# Altium schematic sheet 6DOF_CONTROLLER_Top.SchDoc
size A1; SheetNumber: 1; SheetTotal: 12
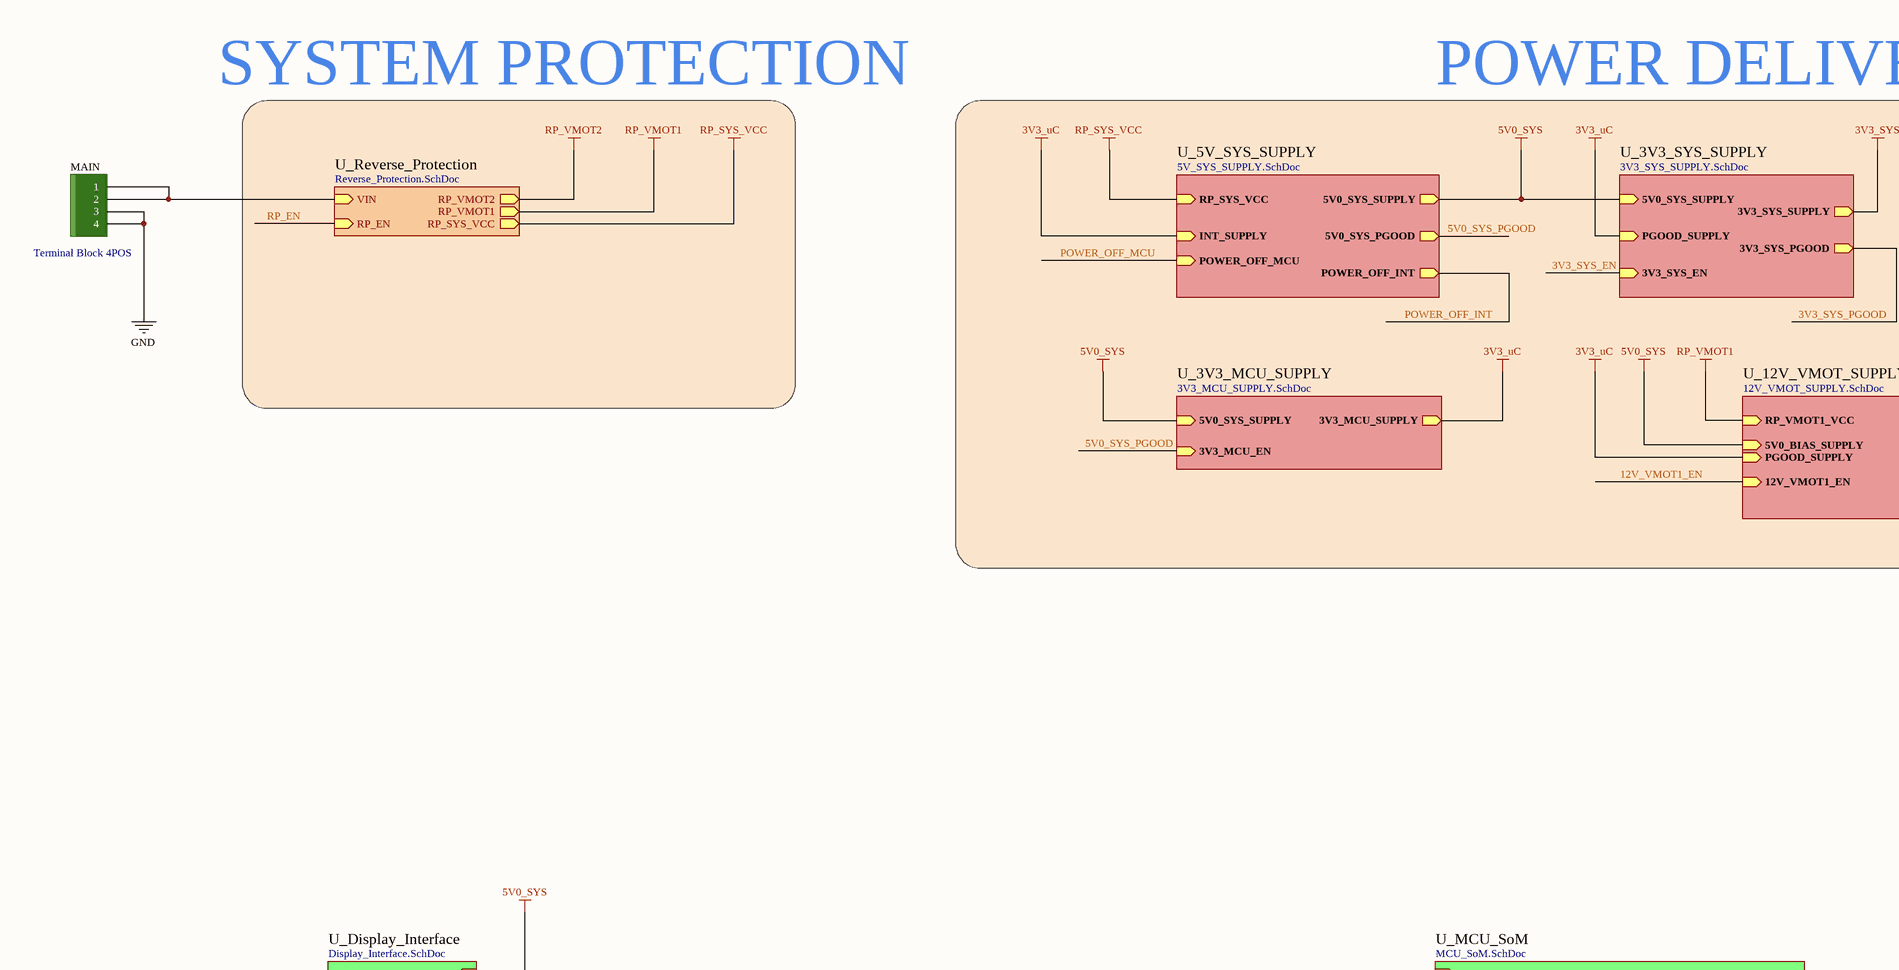
[diagram p0: 6DOF_CONTROLLER_Top.SchDoc, top left]
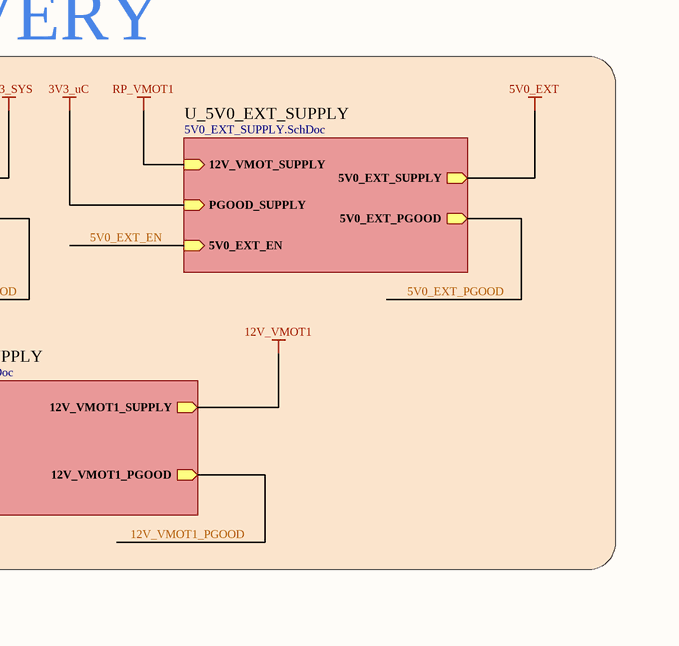
[diagram p1: 6DOF_CONTROLLER_Top.SchDoc, top right]
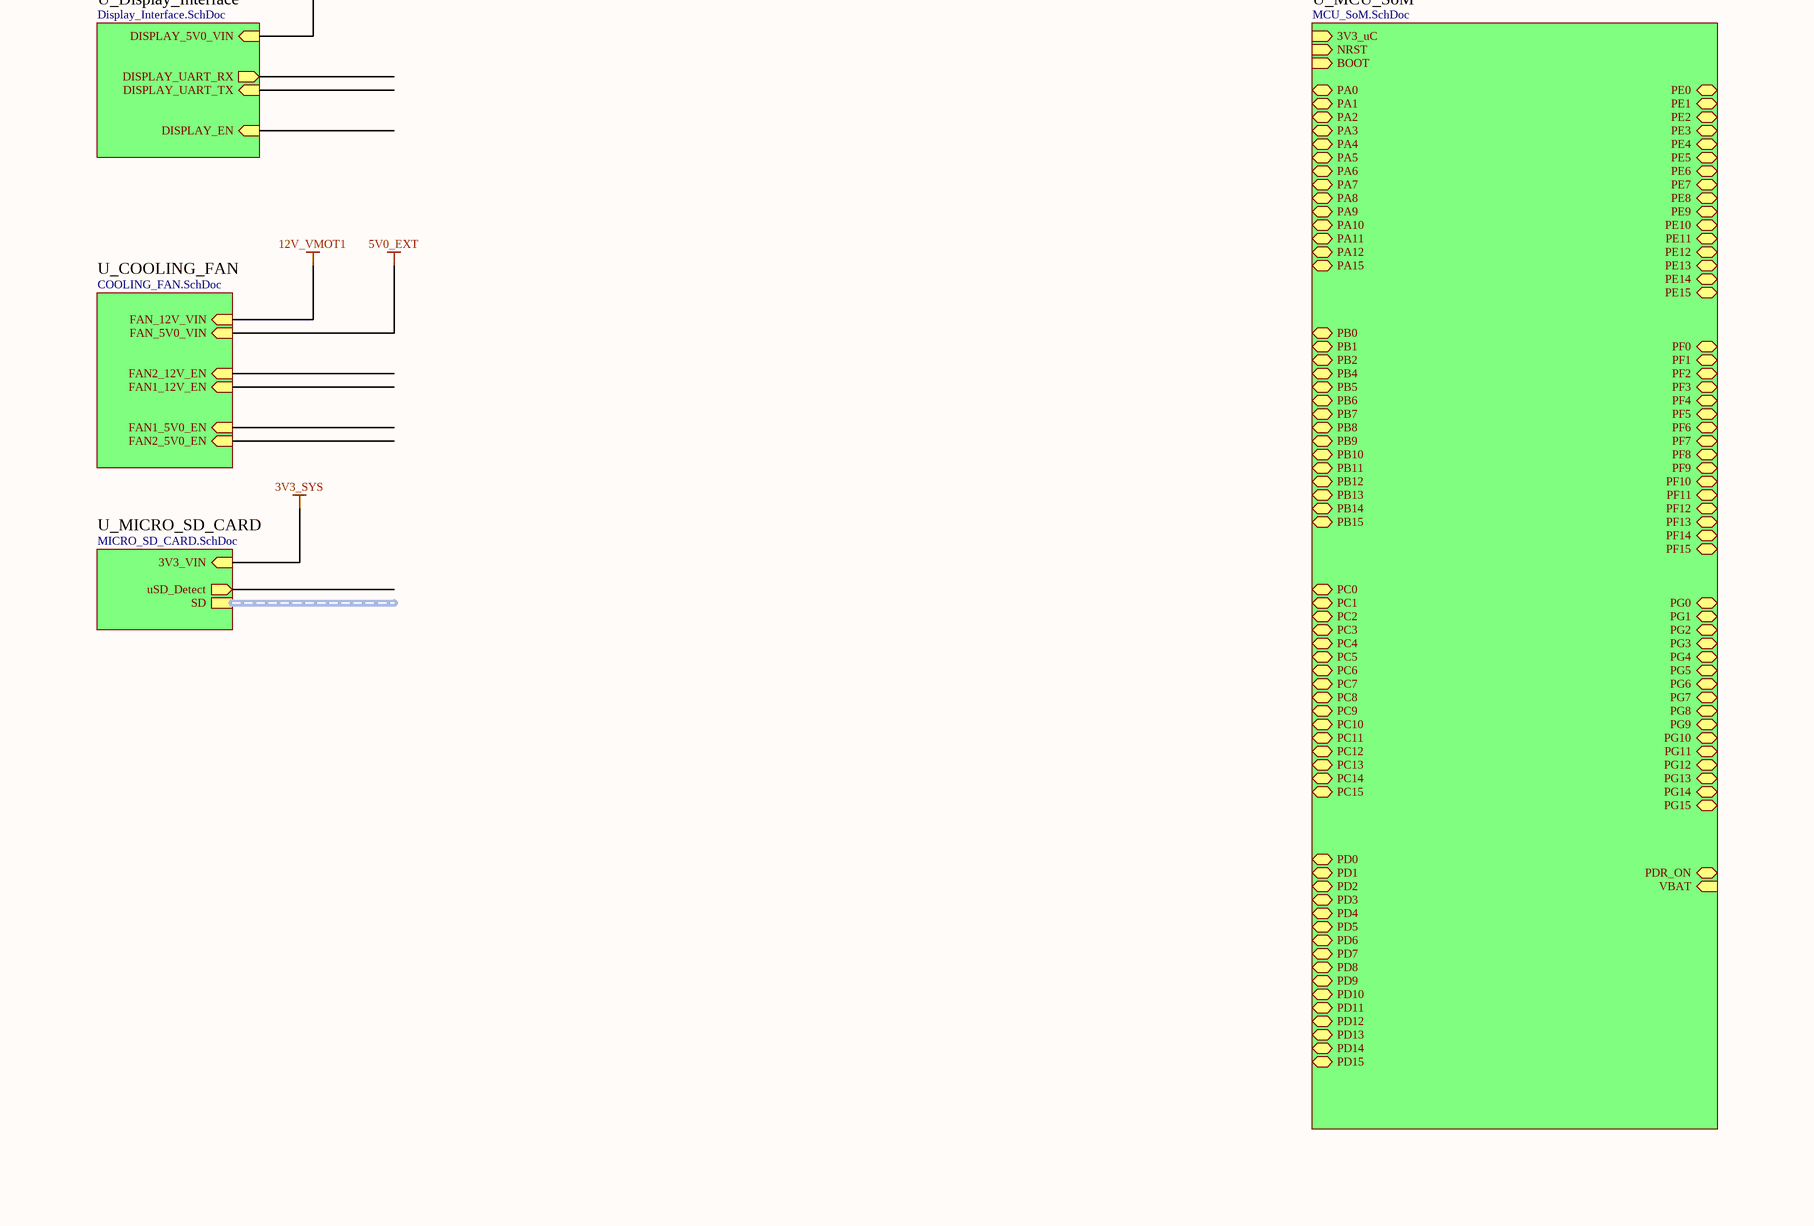
[diagram p2: 6DOF_CONTROLLER_Top.SchDoc, bottom left]
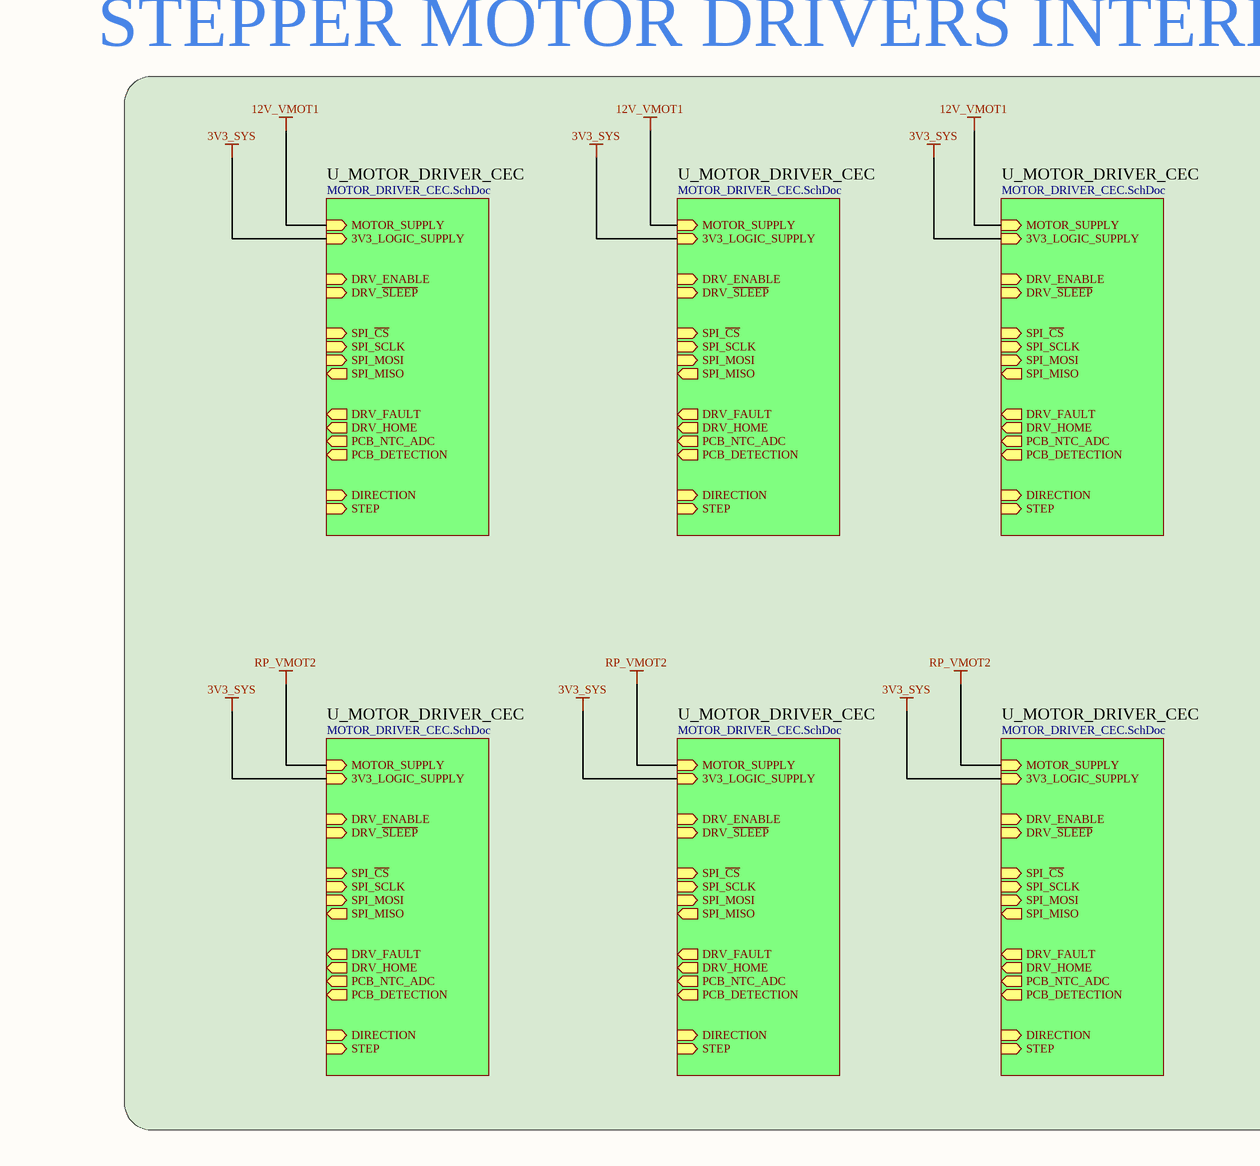
[diagram p3: 6DOF_CONTROLLER_Top.SchDoc, bottom right]

## Parts
MAIN  Terminal Block 4POS  [TERM_BLOCK_5.08mm 4PIN]

## Sub-sheets
U_3V3_MCU_SUPPLY = 3V3_MCU_SUPPLY.SchDoc: 3V3_MCU_SUPPLY (out), 3V3_MCU_EN (in), 5V0_SYS_SUPPLY (in)
U_3V3_SYS_SUPPLY = 3V3_SYS_SUPPLY.SchDoc: 3V3_SYS_PGOOD (out), 3V3_SYS_EN (in), 5V0_SYS_SUPPLY (in), 3V3_SYS_SUPPLY (out), PGOOD_SUPPLY (in)
U_5V0_EXT_SUPPLY = 5V0_EXT_SUPPLY.SchDoc: 5V0_EXT_PGOOD (out), 5V0_EXT_EN (in), 12V_VMOT_SUPPLY (in), 5V0_EXT_SUPPLY (out), PGOOD_SUPPLY (in)
U_5V_SYS_SUPPLY = 5V_SYS_SUPPLY.SchDoc: 5V0_SYS_SUPPLY (out), 5V0_SYS_PGOOD (out), RP_SYS_VCC (in), POWER_OFF_INT (out), POWER_OFF_MCU (in), INT_SUPPLY (in)
U_12V_VMOT_SUPPLY = 12V_VMOT_SUPPLY.SchDoc: RP_VMOT1_VCC (in), PGOOD_SUPPLY (in), 12V_VMOT1_PGOOD (out), 5V0_BIAS_SUPPLY (in), 12V_VMOT1_EN (in), 12V_VMOT1_SUPPLY (out)
U_COOLING_FAN = COOLING_FAN.SchDoc: FAN_12V_VIN (in), FAN1_12V_EN (in), FAN2_12V_EN (in), FAN_5V0_VIN (in), FAN1_5V0_EN (in), FAN2_5V0_EN (in)
U_Display_Interface = Display_Interface.SchDoc: DISPLAY_5V0_VIN (in), DISPLAY_EN (in), DISPLAY_UART_TX (in), DISPLAY_UART_RX (out)
U_MCU_SoM = MCU_SoM.SchDoc: 3V3_uC (in), NRST (in), PE2 (bidir), PE3 (bidir), PE4 (bidir), PE5 (bidir), PE6 (bidir), PC13 (bidir), PC14 (bidir), PC15 (bidir), PC0 (bidir), PC1 (bidir), PC2 (bidir), PC3 (bidir), PC4 (bidir), PC5 (bidir), PB0 (bidir), PB1 (bidir), PB2 (bidir), PF11 (bidir), PF12 (bidir), PF13 (bidir), PF14 (bidir), PF15 (bidir), PB10 (bidir), PB11 (bidir), PE15 (bidir), VBAT (in), PF0 (bidir), PF1 (bidir), PF2 (bidir), PF3 (bidir), PF4 (bidir), PF5 (bidir), PF6 (bidir), PF7 (bidir), PF8 (bidir), PF9 (bidir), PF10 (bidir), PA0 (bidir), PA1 (bidir), PA2 (bidir), PA3 (bidir), PA4 (bidir), PA5 (bidir), PA6 (bidir), PA7 (bidir), PG0 (bidir), PG1 (bidir), PE7 (bidir), PE8 (bidir), PE9 (bidir), PE10 (bidir), PE11 (bidir), PE12 (bidir), PE13 (bidir), PE14 (bidir), PE1 (bidir), PE0 (bidir), PB9 (bidir), PB8 (bidir), BOOT (in), PB7 (bidir), PB6 (bidir), PB5 (bidir), PB4 (bidir), PC12 (bidir), PC11 (bidir), PC10 (bidir), PA15 (bidir), PA12 (bidir), PA11 (bidir), PA10 (bidir), PA9 (bidir), PA8 (bidir), PC9 (bidir), PC8 (bidir), PC7 (bidir), PC6 (bidir), PG8 (bidir), PG7 (bidir), PG6 (bidir), PG5 (bidir), PG4 (bidir), PG3 (bidir), PG2 (bidir), PDR_ON (bidir), PG15 (bidir), PG14 (bidir), PG13 (bidir), PG12 (bidir), PG11 (bidir), PG10 (bidir), PG9 (bidir), PD7 (bidir), PD6 (bidir), PD5 (bidir), PD4 (bidir), PD3 (bidir), PD2 (bidir), PD1 (bidir), PD0 (bidir), PD15 (bidir), PD14 (bidir), PD13 (bidir), PD12 (bidir), PD11 (bidir), PD10 (bidir), PD9 (bidir), PD8 (bidir), PB15 (bidir), PB14 (bidir), PB13 (bidir), PB12 (bidir)
U_MICRO_SD_CARD = MICRO_SD_CARD.SchDoc: SD (harness SD), 3V3_VIN (in), uSD_Detect (out)
U_MOTOR_DRIVER_CEC = MOTOR_DRIVER_CEC.SchDoc: SPI_~{CS} (in), SPI_MISO (out), SPI_MOSI (in), SPI_SCLK (in), DRV_ENABLE (in), DRV_~{SLEEP} (in), MOTOR_SUPPLY (in), 3V3_LOGIC_SUPPLY (in), STEP (in), DRV_FAULT (out), DRV_HOME (out), DIRECTION (in), PCB_NTC_ADC (out), PCB_DETECTION (out)
U_MOTOR_DRIVER_CEC = MOTOR_DRIVER_CEC.SchDoc: SPI_~{CS} (in), SPI_MISO (out), SPI_MOSI (in), SPI_SCLK (in), DRV_ENABLE (in), DRV_~{SLEEP} (in), MOTOR_SUPPLY (in), 3V3_LOGIC_SUPPLY (in), STEP (in), DRV_FAULT (out), DRV_HOME (out), DIRECTION (in), PCB_NTC_ADC (out), PCB_DETECTION (out)
U_MOTOR_DRIVER_CEC = MOTOR_DRIVER_CEC.SchDoc: SPI_~{CS} (in), SPI_MISO (out), SPI_MOSI (in), SPI_SCLK (in), DRV_ENABLE (in), DRV_~{SLEEP} (in), MOTOR_SUPPLY (in), 3V3_LOGIC_SUPPLY (in), STEP (in), DRV_FAULT (out), DRV_HOME (out), DIRECTION (in), PCB_NTC_ADC (out), PCB_DETECTION (out)
U_MOTOR_DRIVER_CEC = MOTOR_DRIVER_CEC.SchDoc: SPI_~{CS} (in), SPI_MISO (out), SPI_MOSI (in), SPI_SCLK (in), DRV_ENABLE (in), DRV_~{SLEEP} (in), MOTOR_SUPPLY (in), 3V3_LOGIC_SUPPLY (in), STEP (in), DRV_FAULT (out), DRV_HOME (out), DIRECTION (in), PCB_NTC_ADC (out), PCB_DETECTION (out)
U_MOTOR_DRIVER_CEC = MOTOR_DRIVER_CEC.SchDoc: SPI_~{CS} (in), SPI_MISO (out), SPI_MOSI (in), SPI_SCLK (in), DRV_ENABLE (in), DRV_~{SLEEP} (in), MOTOR_SUPPLY (in), 3V3_LOGIC_SUPPLY (in), STEP (in), DRV_FAULT (out), DRV_HOME (out), DIRECTION (in), PCB_NTC_ADC (out), PCB_DETECTION (out)
U_MOTOR_DRIVER_CEC = MOTOR_DRIVER_CEC.SchDoc: SPI_~{CS} (in), SPI_MISO (out), SPI_MOSI (in), SPI_SCLK (in), DRV_ENABLE (in), DRV_~{SLEEP} (in), MOTOR_SUPPLY (in), 3V3_LOGIC_SUPPLY (in), STEP (in), DRV_FAULT (out), DRV_HOME (out), DIRECTION (in), PCB_NTC_ADC (out), PCB_DETECTION (out)
U_Reverse_Protection = Reverse_Protection.SchDoc: VIN (in), RP_VMOT2 (out), RP_VMOT1 (out), RP_SYS_VCC (out), RP_EN (in)

## Nets
3V3_SYS: sheet U_3V3_SYS_SUPPLY/3V3_SYS_SUPPLY, sheet U_MOTOR_DRIVER_CEC/3V3_LOGIC_SUPPLY, sheet U_MOTOR_DRIVER_CEC/3V3_LOGIC_SUPPLY, sheet U_MOTOR_DRIVER_CEC/3V3_LOGIC_SUPPLY, sheet U_MOTOR_DRIVER_CEC/3V3_LOGIC_SUPPLY, sheet U_MOTOR_DRIVER_CEC/3V3_LOGIC_SUPPLY, sheet U_MOTOR_DRIVER_CEC/3V3_LOGIC_SUPPLY, sheet U_MICRO_SD_CARD/3V3_VIN
3V3_uC: sheet U_5V_SYS_SUPPLY/INT_SUPPLY, sheet U_3V3_SYS_SUPPLY/PGOOD_SUPPLY, sheet U_5V0_EXT_SUPPLY/PGOOD_SUPPLY, sheet U_3V3_MCU_SUPPLY/3V3_MCU_SUPPLY, sheet U_12V_VMOT_SUPPLY/PGOOD_SUPPLY
5V0_EXT: sheet U_5V0_EXT_SUPPLY/5V0_EXT_SUPPLY, sheet U_COOLING_FAN/FAN_5V0_VIN
5V0_SYS: sheet U_5V_SYS_SUPPLY/5V0_SYS_SUPPLY, sheet U_3V3_SYS_SUPPLY/5V0_SYS_SUPPLY, sheet U_3V3_MCU_SUPPLY/5V0_SYS_SUPPLY, sheet U_12V_VMOT_SUPPLY/5V0_BIAS_SUPPLY, sheet U_Display_Interface/DISPLAY_5V0_VIN
12V_VMOT1: sheet U_MOTOR_DRIVER_CEC/MOTOR_SUPPLY, sheet U_MOTOR_DRIVER_CEC/MOTOR_SUPPLY, sheet U_MOTOR_DRIVER_CEC/MOTOR_SUPPLY, sheet U_12V_VMOT_SUPPLY/12V_VMOT1_SUPPLY, sheet U_COOLING_FAN/FAN_12V_VIN
GND: MAIN.3 MAIN.4
RP_SYS_VCC: sheet U_Reverse_Protection/RP_SYS_VCC, sheet U_5V_SYS_SUPPLY/RP_SYS_VCC
RP_VMOT1: sheet U_Reverse_Protection/RP_VMOT1, sheet U_5V0_EXT_SUPPLY/12V_VMOT_SUPPLY, sheet U_12V_VMOT_SUPPLY/RP_VMOT1_VCC
RP_VMOT2: sheet U_Reverse_Protection/RP_VMOT2, sheet U_MOTOR_DRIVER_CEC/MOTOR_SUPPLY, sheet U_MOTOR_DRIVER_CEC/MOTOR_SUPPLY, sheet U_MOTOR_DRIVER_CEC/MOTOR_SUPPLY
3V3_SYS_EN: sheet U_3V3_SYS_SUPPLY/3V3_SYS_EN
3V3_SYS_PGOOD: sheet U_3V3_SYS_SUPPLY/3V3_SYS_PGOOD
5V0_EXT_EN: sheet U_5V0_EXT_SUPPLY/5V0_EXT_EN
5V0_EXT_PGOOD: sheet U_5V0_EXT_SUPPLY/5V0_EXT_PGOOD
5V0_SYS_PGOOD: sheet U_5V_SYS_SUPPLY/5V0_SYS_PGOOD, sheet U_3V3_MCU_SUPPLY/3V3_MCU_EN
12V_VMOT1_EN: sheet U_12V_VMOT_SUPPLY/12V_VMOT1_EN
12V_VMOT1_PGOOD: sheet U_12V_VMOT_SUPPLY/12V_VMOT1_PGOOD
POWER_OFF_INT: sheet U_5V_SYS_SUPPLY/POWER_OFF_INT
POWER_OFF_MCU: sheet U_5V_SYS_SUPPLY/POWER_OFF_MCU
RP_EN: sheet U_Reverse_Protection/RP_EN
NetMAIN_1: MAIN.1 MAIN.2 ; sheet U_Reverse_Protection/VIN

## Notes on the sheet
- SYSTEM PROTECTION
- POWER DELIVERY
- STEPPER MOTOR DRIVERS INTERFACE

## Library data of the parts
MAIN = 00000011: XY2500R-D 250V 12A 5.08mm; ComponentLink1Description: Mikroprinc; ComponentLink1URL: https://www.mikroprinc.com/sr/proizvod/konektor-za-klemu-4-pol-pod-uglom-90-print-rm-508-xy2500